# Altium schematic sheet BT5.SchDoc
size A4; SheetNumber: 2; SheetTotal: 3
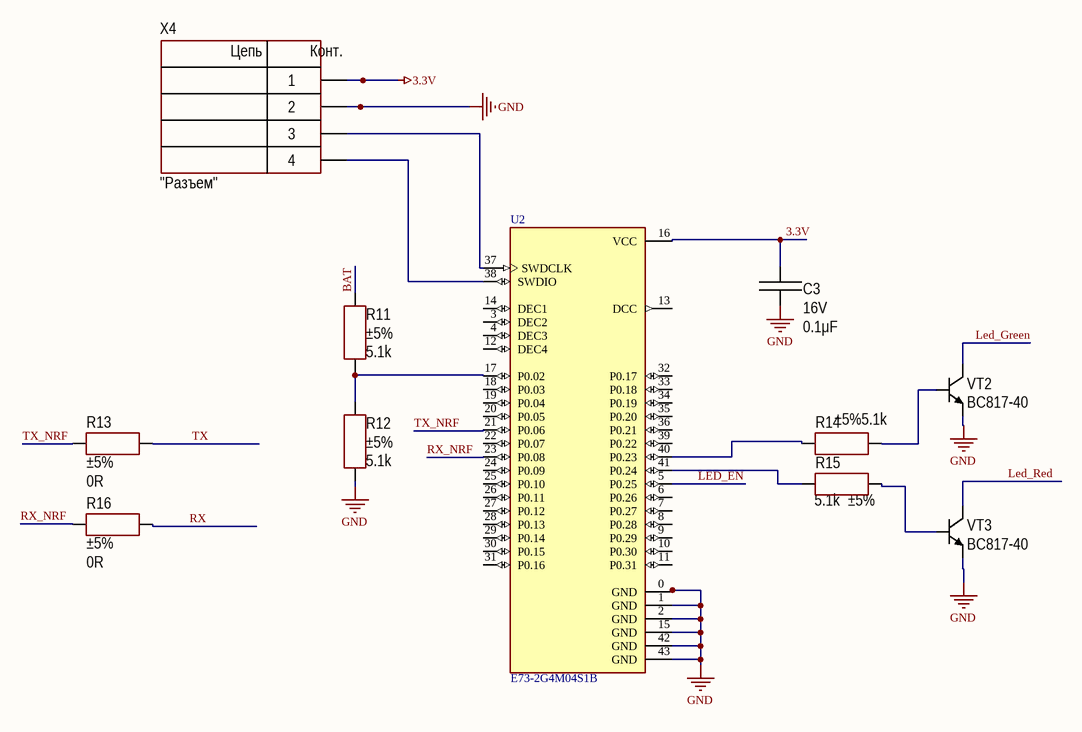
[diagram p0: BT5.SchDoc]

## Parts
C3  value 0.1μF  Voltage: 16V  [CAP: 0805]
R11  value 5.1k  Tolerance: ±5%  [RES: 0805]
R12  value 5.1k  Tolerance: ±5%  [RES: 0805]
R13  value 0R  Tolerance: ±5%  [RES: 0805]
R14  value 5.1k  Tolerance: ±5%  [RES: 0805]
R15  value 5.1k  Tolerance: ±5%  [RES: 0805]
R16  value 0R  Tolerance: ±5%  [RES: 0805]
U2  E73-2G4M04S1B  [XCVR_E73-2G4M04S1B]
VT2  PartNumber: ВС817-40  [SOT23]
VT3  PartNumber: ВС817-40  [SOT23]
X4  CommentText: "Разъем"  [CON: PLS-4]

## Nets
3.3V: C3.2 U2.16(VCC) X4.1
GND: C3.1 R12.2 U2.0(GND) U2.1(GND) U2.2(GND) U2.15(GND) U2.42(GND) U2.43(GND) VT2.2(E) VT3.2(E) X4.2
BAT: R11.1
LED_EN: U2.5(P0.25)
Led_Green: VT2.3(C)
Led_Red: VT3.3(C)
RX: R16.2
RX_NRF: R16.1 U2.23(P0.08)
TX: R13.2
TX_NRF: R13.1 U2.21(P0.06)
NetR11_2: R11.2 R12.1 U2.17(P0.02)
NetR14_1: R14.1 U2.40(P0.23)
NetR14_2: R14.2 VT2.1(B)
NetR15_1: R15.1 U2.41(P0.24)
NetR15_2: R15.2 VT3.1(B)
NetU2_37: U2.37(SWDCLK) X4.3
NetU2_38: U2.38(SWDIO) X4.4

Not connected (* = marked no-connect by the designer): U2 3(DEC2) 4(DEC3) 6(P0.26) 7(P0.27) 8(P0.28) 9(P0.29) 10(P0.30) 11(P0.31) 12(DEC4) 13(DCC) 14(DEC1) 18(P0.03) 19(P0.04) 20(P0.05) 22(P0.07) 24(P0.09) 25(P0.10) 26(P0.11) 27(P0.12) 28(P0.13) 29(P0.14) 30(P0.15) 31(P0.16) 32(P0.17) 33(P0.18) 34(P0.19) 35(P0.20) 36(P0.21) 39(P0.22)

## Notes on the sheet
- (in symbol PLS-4) Цепь; Конт.

## Library data of the parts
C3 = Ceramic_0805: Manufacturer: Yageo; PartNumber: CC0805KRX7R7BB104; ValueManufacturerPartNumber: Ceramic capacitor, 0.1μF, X7R, ±10%, 16V, 0805, -55...+125°C; TypeCapacitor: Ceramic capacitor; Tolerance: ±10%; TypeDielectric: X7R; Package: 0805; HelpURL: https://www.digikey.com/product-detail/en/yageo/CC0805KRX7R7BB104/311-1142-1-ND/303052; Temperature: -55...+125°C
R11 R12 R14 R15 = Resistor_0805: Manufacturer: Yageo; PartNumber: RC0805JR-075K1L; ValueManufacturerPartNumber: Resistor film, 5.1k, ±5%, 0805, 0.125W, -55...+125°C; TypeResistor: Resistor film; Power: 0.125W; Package: 0805; HelpURL: https://www.digikey.com/product-detail/en/yageo/RC0805JR-07100RL/311-100ARCT-ND/731185; Temperature: -55...+125°C
R13 R16 = Resistor_0805: Manufacturer: Yageo; PartNumber: RC0805JR-070RL; ValueManufacturerPartNumber: Resistor film, 0R, ±5%, 0805, 0.125W, -55...+125°C; TypeResistor: Resistor film; Power: 0.125W; Package: 0805; HelpURL: https://www.digikey.com/product-detail/en/yageo/RC0805JR-07100RL/311-100ARCT-ND/731185; Temperature: -55...+125°C
U2 = E73-2G4M04S1B: nRF52832 BLE 4.2/5.0 SMD Wireless Module; MF: EBYTE; Availability: Unavailable; Price: None; Package: Package; MP: E73-2G4M04S1B; Value: *; SnapEDA_Link: https://www.snapeda.com/parts/E73-2G4M04S1B/EBYTE/view-part/4219264/?ref=snap; BuyPart: https://www.snapeda.com/parts/E73-2G4M04S1B/EBYTE/view-part/4219264/?ref=eda
VT2 VT3 = BJT_NPN_132: Manufacturer: ON Semiconductor; ValueManufacturerPartNumber: NPN transistor, 45V, 100mA, 100MHz, 250mW, 0.6V, 420, SOT-23, -55...+125°C; TypeTransistor: NPN transistor; VoltageCE: 45V; CurrentCE: 100mA; VoltageSaturation: 0.6V; Frequency: 100MHz; CurrentGain: 420; MaxPower: 250mW; Package: SOT-23; HelpURL: https://www.digikey.com/product-detail/en/on-semiconductor/BC847CLT1G/BC847CLT1GOSCT-ND/917836; Temperature: -55...+125°C
X4 = PLS-4: Manufacturer: Connfly; ValueManufacturerPartNumber: Connector, 4pin, 2.54mm, 500VAC, 3A; TypeConnector: Connector; VoltageMax: 500VAC; Pitch: 2.54mm; CurrentMax: 3A; Multichannel: 4pin; HelpURL: https://www.chipdip.ru/product/pls-4; PartNumber: PLS-4